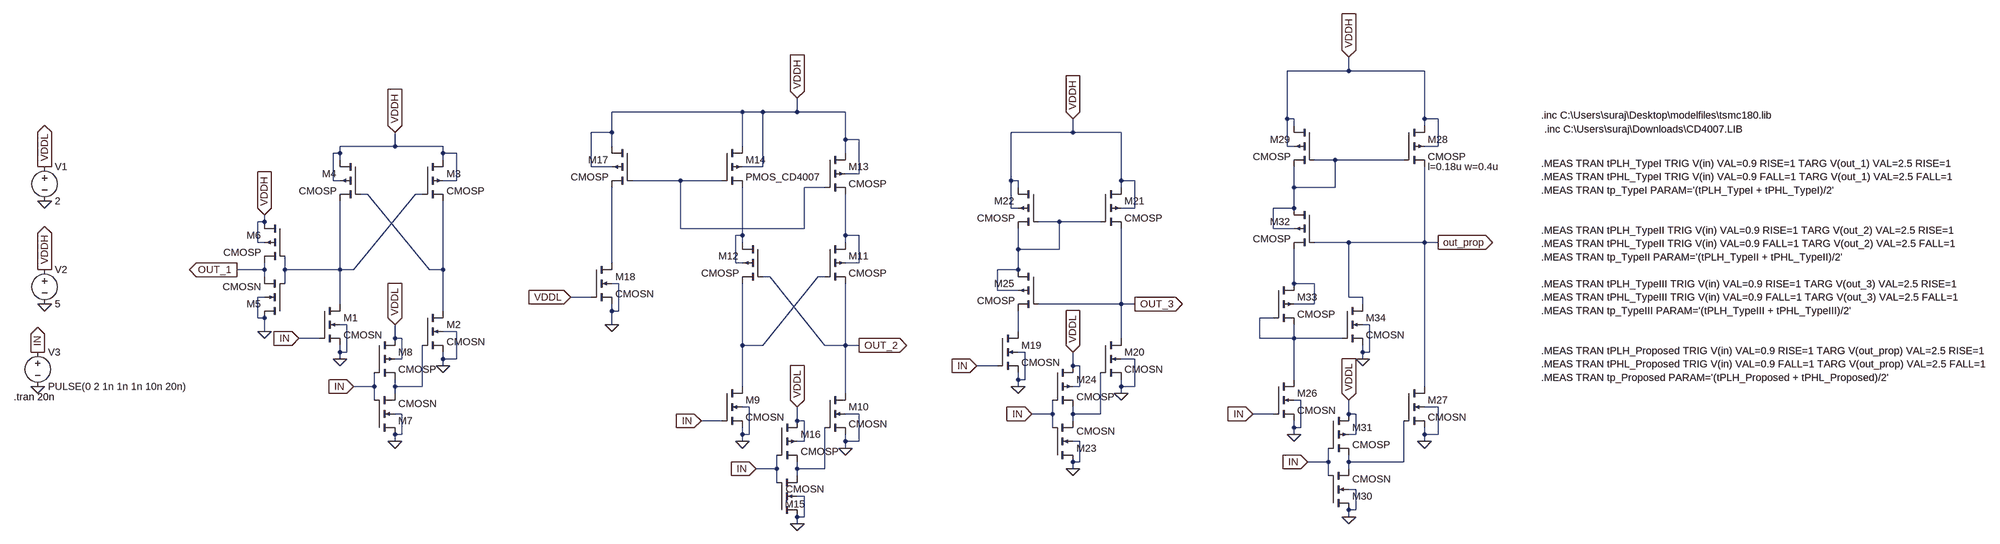
[diagram p0: schematic level_shifter_02.asc]
level_shifter_02.asc, the LTspice schematic file:
Version 4
SHEET 1 4096 1280
WIRE 2816 -160 2816 -192
WIRE 2816 -160 2672 -160
WIRE 2992 -160 2816 -160
WIRE 1168 -64 864 -64
WIRE 1216 -64 1168 -64
WIRE 1296 -64 1296 -96
WIRE 1296 -64 1216 -64
WIRE 1408 -64 1296 -64
WIRE 2672 -48 2672 -160
WIRE 2688 -48 2672 -48
WIRE 2992 -48 2992 -160
WIRE 3024 -48 2992 -48
WIRE 2688 -32 2688 -48
WIRE 2992 -32 2992 -48
WIRE 864 -16 864 -64
WIRE 864 -16 816 -16
WIRE 2080 -16 2080 -48
WIRE 2080 -16 1936 -16
WIRE 2192 -16 2080 -16
WIRE 1408 0 1408 -64
WIRE 1440 0 1408 0
WIRE 272 16 272 -16
WIRE 272 16 144 16
WIRE 384 16 272 16
WIRE 864 16 864 -16
WIRE 1168 16 1168 -64
WIRE 2672 16 2672 -48
WIRE 2688 16 2672 16
WIRE 3024 16 3024 -48
WIRE 3024 16 2992 16
WIRE 144 32 144 16
WIRE 144 32 128 32
WIRE 384 32 384 16
WIRE 416 32 384 32
WIRE 1408 32 1408 0
WIRE 144 48 144 32
WIRE 384 48 384 32
WIRE 2784 48 2736 48
WIRE 2944 48 2784 48
WIRE 816 64 816 -16
WIRE 864 64 816 64
WIRE 1216 64 1216 -64
WIRE 1216 64 1168 64
WIRE 1440 80 1440 0
WIRE 1440 80 1408 80
WIRE 128 96 128 32
WIRE 144 96 128 96
WIRE 416 96 416 32
WIRE 416 96 384 96
WIRE 1024 96 912 96
WIRE 1120 96 1024 96
WIRE 1936 96 1936 -16
WIRE 1952 96 1936 96
WIRE 2192 96 2192 -16
WIRE 2224 96 2192 96
WIRE 1360 112 1312 112
WIRE 1952 112 1952 96
WIRE 2192 112 2192 96
WIRE 2688 112 2688 64
WIRE 2784 112 2784 48
WIRE 2784 112 2688 112
WIRE 208 128 192 128
WIRE 336 128 320 128
WIRE 1936 160 1936 96
WIRE 1952 160 1936 160
WIRE 2224 160 2224 96
WIRE 2224 160 2192 160
WIRE 2688 160 2688 112
WIRE 2688 160 2640 160
WIRE -32 192 -32 176
WIRE -32 192 -48 192
WIRE 2048 192 2000 192
WIRE 2144 192 2048 192
WIRE 1024 208 1024 96
WIRE 1312 208 1312 112
WIRE 1312 208 1024 208
WIRE 2640 208 2640 160
WIRE 2688 208 2640 208
WIRE 1168 224 1168 112
WIRE 1168 224 1152 224
WIRE 1408 224 1408 128
WIRE 1440 224 1408 224
WIRE -48 240 -48 192
WIRE -32 240 -48 240
WIRE 1168 240 1168 224
WIRE 1408 240 1408 224
WIRE 2816 240 2736 240
WIRE 2992 240 2992 64
WIRE 2992 240 2816 240
WIRE 3024 240 2992 240
WIRE 1952 256 1952 208
WIRE 2048 256 2048 192
WIRE 2048 256 1952 256
WIRE 864 288 864 112
WIRE 1152 288 1152 224
WIRE 1168 288 1152 288
WIRE 1440 288 1440 224
WIRE 1440 288 1408 288
WIRE -32 304 -32 288
WIRE -32 304 -96 304
WIRE 16 304 16 272
WIRE 144 304 144 144
WIRE 144 304 16 304
WIRE 176 304 320 128
WIRE 176 304 144 304
WIRE 352 304 208 128
WIRE 384 304 384 144
WIRE 384 304 352 304
WIRE 1952 304 1952 256
WIRE 1952 304 1904 304
WIRE -32 320 -32 304
WIRE 1232 320 1216 320
WIRE 1360 320 1344 320
WIRE 16 336 16 304
WIRE 880 336 864 336
WIRE 2688 336 2688 256
WIRE 2736 336 2688 336
WIRE 1904 352 1904 304
WIRE 1952 352 1904 352
WIRE -32 368 -48 368
WIRE 816 368 768 368
WIRE 2816 368 2816 240
WIRE 2848 368 2816 368
WIRE 144 384 144 304
WIRE 2192 384 2192 208
WIRE 2192 384 2000 384
WIRE 2224 384 2192 384
WIRE 2736 384 2736 336
WIRE 2736 384 2688 384
WIRE 2848 384 2848 368
WIRE 384 400 384 304
WIRE 864 400 864 384
WIRE 880 400 880 336
WIRE 880 400 864 400
WIRE -48 416 -48 368
WIRE -32 416 -48 416
WIRE 2640 416 2608 416
WIRE 160 432 144 432
WIRE 864 432 864 400
WIRE 2864 432 2848 432
WIRE -32 448 -32 416
WIRE 416 448 384 448
WIRE 1952 448 1952 400
WIRE 96 464 48 464
WIRE 272 464 272 432
WIRE 288 464 272 464
WIRE 2192 464 2192 384
WIRE 2608 464 2608 416
WIRE 2688 464 2688 432
WIRE 2688 464 2608 464
WIRE 2800 464 2688 464
WIRE 1168 480 1168 336
WIRE 1216 480 1344 320
WIRE 1216 480 1168 480
WIRE 1360 480 1232 320
WIRE 1408 480 1408 336
WIRE 1408 480 1360 480
WIRE 1440 480 1408 480
WIRE 144 496 144 480
WIRE 160 496 160 432
WIRE 160 496 144 496
WIRE 1968 496 1952 496
WIRE 2848 496 2848 480
WIRE 2864 496 2864 432
WIRE 2864 496 2848 496
WIRE 144 512 144 496
WIRE 288 512 288 464
WIRE 288 512 272 512
WIRE 384 512 384 496
WIRE 416 512 416 448
WIRE 416 512 384 512
WIRE 2224 512 2192 512
WIRE 2848 512 2848 496
WIRE 384 528 384 512
WIRE 1904 528 1856 528
WIRE 2080 528 2080 496
WIRE 2096 528 2080 528
WIRE 1952 560 1952 544
WIRE 1968 560 1968 496
WIRE 1968 560 1952 560
WIRE 2688 560 2688 464
WIRE 224 576 224 544
WIRE 224 576 176 576
WIRE 272 576 272 560
WIRE 336 576 336 480
WIRE 336 576 272 576
WIRE 1168 576 1168 480
WIRE 1952 576 1952 560
WIRE 2096 576 2096 528
WIRE 2096 576 2080 576
WIRE 2192 576 2192 560
WIRE 2224 576 2224 512
WIRE 2224 576 2192 576
WIRE 2992 576 2992 240
WIRE 272 592 272 576
WIRE 1408 592 1408 480
WIRE 2192 592 2192 576
WIRE 224 608 224 576
WIRE 2704 608 2688 608
WIRE 1184 624 1168 624
WIRE 3024 624 2992 624
WIRE 288 640 272 640
WIRE 1440 640 1408 640
WIRE 2032 640 2032 608
WIRE 2032 640 1984 640
WIRE 2080 640 2080 624
WIRE 2144 640 2144 544
WIRE 2144 640 2080 640
WIRE 2640 640 2592 640
WIRE 2816 640 2816 608
WIRE 2832 640 2816 640
WIRE 1120 656 1072 656
WIRE 1296 656 1296 624
WIRE 1312 656 1296 656
WIRE 2080 656 2080 640
WIRE 2032 672 2032 640
WIRE 2688 672 2688 656
WIRE 2704 672 2704 608
WIRE 2704 672 2688 672
WIRE 288 688 288 640
WIRE 288 688 272 688
WIRE 1168 688 1168 672
WIRE 1184 688 1184 624
WIRE 1184 688 1168 688
WIRE 2688 688 2688 672
WIRE 2832 688 2832 640
WIRE 2832 688 2816 688
WIRE 2992 688 2992 672
WIRE 3024 688 3024 624
WIRE 3024 688 2992 688
WIRE 272 704 272 688
WIRE 1168 704 1168 688
WIRE 1312 704 1312 656
WIRE 1312 704 1296 704
WIRE 1408 704 1408 688
WIRE 1440 704 1440 640
WIRE 1440 704 1408 704
WIRE 2096 704 2080 704
WIRE 2992 704 2992 688
WIRE 1408 720 1408 704
WIRE 2096 752 2096 704
WIRE 2096 752 2080 752
WIRE 2768 752 2768 720
WIRE 2768 752 2720 752
WIRE 2816 752 2816 736
WIRE 2944 752 2944 656
WIRE 2944 752 2816 752
WIRE 1248 768 1248 736
WIRE 1248 768 1200 768
WIRE 1296 768 1296 752
WIRE 1360 768 1360 672
WIRE 1360 768 1296 768
WIRE 2080 768 2080 752
WIRE 2816 768 2816 752
WIRE 1296 784 1296 768
WIRE 2768 784 2768 752
WIRE 1248 800 1248 768
WIRE 2832 816 2816 816
WIRE 1312 832 1296 832
WIRE 2832 864 2832 816
WIRE 2832 864 2816 864
WIRE 1312 880 1312 832
WIRE 1312 880 1296 880
WIRE 2816 880 2816 864
WIRE 1296 896 1296 880
FLAG 144 512 0
FLAG 272 704 0
FLAG 272 -16 VDDH
IOPIN 272 -16 In
FLAG -32 176 VDDH
IOPIN -32 176 In
FLAG 272 432 VDDL
IOPIN 272 432 In
FLAG 48 464 IN
IOPIN 48 464 In
FLAG 176 576 IN
IOPIN 176 576 In
FLAG -32 448 0
FLAG 384 528 0
FLAG -96 304 OUT_1
IOPIN -96 304 Out
FLAG -560 576 0
FLAG -544 384 0
FLAG -544 144 0
FLAG -544 64 VDDL
IOPIN -544 64 Out
FLAG -544 304 VDDH
IOPIN -544 304 Out
FLAG -560 496 IN
IOPIN -560 496 Out
FLAG 1168 704 0
FLAG 1296 896 0
FLAG 1296 -96 VDDH
IOPIN 1296 -96 In
FLAG 1296 624 VDDL
IOPIN 1296 624 In
FLAG 1072 656 IN
IOPIN 1072 656 In
FLAG 1200 768 IN
IOPIN 1200 768 In
FLAG 1408 720 0
FLAG 864 432 0
FLAG 768 368 VDDL
IOPIN 768 368 In
FLAG 1952 576 0
FLAG 2080 768 0
FLAG 2080 -48 VDDH
IOPIN 2080 -48 In
FLAG 2080 496 VDDL
IOPIN 2080 496 In
FLAG 1856 528 IN
IOPIN 1856 528 In
FLAG 1984 640 IN
IOPIN 1984 640 In
FLAG 2192 592 0
FLAG 2224 384 OUT_3
IOPIN 2224 384 Out
FLAG 2688 688 0
FLAG 2816 880 0
FLAG 2816 -192 VDDH
IOPIN 2816 -192 In
FLAG 2816 608 VDDL
IOPIN 2816 608 In
FLAG 2592 640 IN
IOPIN 2592 640 In
FLAG 2720 752 IN
IOPIN 2720 752 In
FLAG 2992 704 0
FLAG 3024 240 out_prop
IOPIN 3024 240 Out
FLAG 2848 512 0
FLAG 1440 480 OUT_2
IOPIN 1440 480 Out
SYMBOL nmos4 96 384 R0
SYMATTR InstName M1
SYMATTR Value CMOSN
SYMATTR Value2 l=0.18u w=2u
SYMBOL nmos4 336 400 R0
SYMATTR InstName M2
SYMATTR Value CMOSN
SYMATTR Value2 l=0.18u w=3u
SYMBOL pmos4 336 48 R0
SYMATTR InstName M3
SYMATTR Value CMOSP
SYMATTR Value2 l=0.18u w=0.4u
SYMBOL pmos4 192 48 M0
SYMATTR InstName M4
SYMATTR Value CMOSP
SYMATTR Value2 l=5u w=0.4u
SYMBOL nmos4 16 416 R180
SYMATTR InstName M5
SYMATTR Value CMOSN
SYMATTR Value2 l=0.18u w=5u
SYMBOL pmos4 16 192 M0
SYMATTR InstName M6
SYMATTR Value CMOSP
SYMATTR Value2 l=0.18u w=10u
SYMBOL nmos4 224 688 M180
SYMATTR InstName M7
SYMATTR Value CMOSN
SYMATTR Value2 l=0.18u w=5u
SYMBOL pmos4 224 464 R0
SYMATTR InstName M8
SYMATTR Value CMOSP
SYMATTR Value2 l=0.18u w=10u
SYMBOL voltage -544 48 R0
WINDOW 123 0 0 Left 0
WINDOW 39 0 0 Left 0
SYMATTR InstName V1
SYMATTR Value 2
SYMBOL voltage -544 288 R0
WINDOW 123 0 0 Left 0
WINDOW 39 0 0 Left 0
SYMATTR InstName V2
SYMATTR Value 5
SYMBOL voltage -560 480 R0
WINDOW 123 0 0 Left 0
WINDOW 39 0 0 Left 0
SYMATTR InstName V3
SYMATTR Value PULSE(0 2 1n 1n 1n 10n 20n)
SYMBOL nmos4 1120 576 R0
SYMATTR InstName M9
SYMATTR Value CMOSN
SYMATTR Value2 l=0.18u w=3u
SYMBOL nmos4 1360 592 R0
SYMATTR InstName M10
SYMATTR Value CMOSN
SYMATTR Value2 l=0.18u w=4u
SYMBOL pmos4 1360 240 R0
SYMATTR InstName M11
SYMATTR Value CMOSP
SYMATTR Value2 l=0.18u w=0.4u
SYMBOL pmos4 1216 240 M0
SYMATTR InstName M12
SYMATTR Value CMOSP
SYMATTR Value2 l=0.18u w=0.4u
SYMBOL nmos4 1248 880 M180
WINDOW 0 19 30 Left 2
WINDOW 3 21 65 Left 2
SYMATTR InstName M15
SYMATTR Value CMOSN
SYMATTR Value2 l=0.18u w=1u
SYMBOL pmos4 1248 656 R0
SYMATTR InstName M16
SYMATTR Value CMOSP
SYMATTR Value2 l=0.18u w=2u
SYMBOL pmos4 1360 32 R0
SYMATTR InstName M13
SYMATTR Value CMOSP
SYMATTR Value2 l=0.18u w=0.40u
SYMBOL pmos4 1120 16 R0
SYMATTR InstName M14
SYMATTR Value2 l=5u w=10u
SYMATTR Value PMOS_CD4007
SYMBOL pmos4 912 16 M0
SYMATTR InstName M17
SYMATTR Value CMOSP
SYMATTR Value2 l=5u w=0.4u
SYMBOL nmos4 816 288 R0
SYMATTR InstName M18
SYMATTR Value CMOSN
SYMATTR Value2 l=0.18u w=3u
SYMBOL nmos4 1904 448 R0
SYMATTR InstName M19
SYMATTR Value CMOSN
SYMATTR Value2 l=0.18u w=3u
SYMBOL nmos4 2144 464 R0
SYMATTR InstName M20
SYMATTR Value CMOSN
SYMATTR Value2 l=0.18u w=2u
SYMBOL pmos4 2144 112 R0
SYMATTR InstName M21
SYMATTR Value CMOSP
SYMATTR Value2 l=0.18u w=0.2u
SYMBOL pmos4 2000 112 M0
SYMATTR InstName M22
SYMATTR Value CMOSP
SYMATTR Value2 l=5u w=0.4u
SYMBOL nmos4 2032 752 M180
SYMATTR InstName M23
SYMATTR Value CMOSN
SYMATTR Value2 l=0.18u w=2u
SYMBOL pmos4 2032 528 R0
SYMATTR InstName M24
SYMATTR Value CMOSP
SYMATTR Value2 l=0.18u w=4u
SYMBOL pmos4 2000 304 M0
SYMATTR InstName M25
SYMATTR Value CMOSP
SYMATTR Value2 l=0.18u w=0.2u
SYMBOL nmos4 2640 560 R0
SYMATTR InstName M26
SYMATTR Value CMOSN
SYMATTR Value2 l=0.18u w=5u
SYMBOL nmos4 2944 576 R0
SYMATTR InstName M27
SYMATTR Value CMOSN
SYMATTR Value2 l=0.18u w=2u
SYMBOL pmos4 2944 -32 R0
WINDOW 123 56 96 Left 2
SYMATTR Value2 l=0.18u w=0.4u
SYMATTR InstName M28
SYMATTR Value CMOSP
SYMBOL pmos4 2736 -32 M0
SYMATTR InstName M29
SYMATTR Value CMOSP
SYMATTR Value2 l=5u w=0.2u
SYMBOL nmos4 2768 864 M180
SYMATTR InstName M30
SYMATTR Value CMOSN
SYMATTR Value2 l=0.18u w=1u
SYMBOL pmos4 2768 640 R0
SYMATTR InstName M31
SYMATTR Value CMOSP
SYMATTR Value2 l=0.18u w=2u
SYMBOL pmos4 2736 160 M0
SYMATTR InstName M32
SYMATTR Value CMOSP
SYMATTR Value2 l=0.18u w=0.4u
SYMBOL pmos4 2640 336 R0
SYMATTR InstName M33
SYMATTR Value CMOSP
SYMATTR Value2 l=0.18u w=0.4u
SYMBOL nmos4 2800 384 R0
SYMATTR InstName M34
SYMATTR Value CMOSN
SYMATTR Value2 l=0.18u w=0.4u
TEXT -616 600 Left 2 !.tran 20n
TEXT 3272 -56 Left 2 !.inc C:\\Users\\suraj\\Desktop\\modelfiles\\tsmc180.lib
TEXT 3280 -24 Left 2 !.inc C:\\Users\\suraj\\Downloads\\CD4007.LIB
TEXT 3272 56 Left 2 !.MEAS TRAN tPLH_TypeI TRIG V(in) VAL=0.9 RISE=1 TARG V(out_1) VAL=2.5 RISE=1\n.MEAS TRAN tPHL_TypeI TRIG V(in) VAL=0.9 FALL=1 TARG V(out_1) VAL=2.5 FALL=1\n.MEAS TRAN tp_TypeI PARAM='(tPLH_TypeI + tPHL_TypeI)/2'\n \n \n.MEAS TRAN tPLH_TypeII TRIG V(in) VAL=0.9 RISE=1 TARG V(out_2) VAL=2.5 RISE=1\n.MEAS TRAN tPHL_TypeII TRIG V(in) VAL=0.9 FALL=1 TARG V(out_2) VAL=2.5 FALL=1\n.MEAS TRAN tp_TypeII PARAM='(tPLH_TypeII + tPHL_TypeII)/2'\n \n.MEAS TRAN tPLH_TypeIII TRIG V(in) VAL=0.9 RISE=1 TARG V(out_3) VAL=2.5 RISE=1\n.MEAS TRAN tPHL_TypeIII TRIG V(in) VAL=0.9 FALL=1 TARG V(out_3) VAL=2.5 FALL=1\n.MEAS TRAN tp_TypeIII PARAM='(tPLH_TypeIII + tPHL_TypeIII)/2'\n \n \n.MEAS TRAN tPLH_Proposed TRIG V(in) VAL=0.9 RISE=1 TARG V(out_prop) VAL=2.5 RISE=1\n.MEAS TRAN tPHL_Proposed TRIG V(in) VAL=0.9 FALL=1 TARG V(out_prop) VAL=2.5 FALL=1\n.MEAS TRAN tp_Proposed PARAM='(tPLH_Proposed + tPHL_Proposed)/2'

The netlist it stands for:
* level_shifter_02.asc
M1 N004 IN 0 0 CMOSN l=0.18u w=2u
M2 N003 N013 0 0 CMOSN l=0.18u w=3u
M3 VDDH N004 N003 VDDH CMOSP l=0.18u w=0.4u
M4 VDDH N003 N004 VDDH CMOSP l=5u w=0.4u
M5 0 N004 OUT_1 0 CMOSN l=0.18u w=5u
M6 VDDH N004 OUT_1 VDDH CMOSP l=0.18u w=10u
M7 0 IN N013 0 CMOSN l=0.18u w=5u
M8 VDDL IN N013 VDDL CMOSP l=0.18u w=10u
V1 VDDL 0 2
V2 VDDH 0 5
V3 IN 0 PULSE(0 2 1n 1n 1n 10n 20n)
M9 N009 IN 0 0 CMOSN l=0.18u w=3u
M10 OUT_2 N016 0 0 CMOSN l=0.18u w=4u
M11 N007 N009 OUT_2 N007 CMOSP l=0.18u w=0.4u
M12 N006 OUT_2 N009 N006 CMOSP l=0.18u w=0.4u
M15 0 IN N016 0 CMOSN l=0.18u w=1u
M16 VDDL IN N016 VDDL CMOSP l=0.18u w=2u
M13 VDDH N002 N007 VDDH CMOSP l=0.18u w=0.40u
M14 VDDH N002 N006 VDDH PMOS_CD4007 l=5u w=10u
M17 VDDH N002 N008 VDDH CMOSP l=5u w=0.4u
M18 N008 VDDL 0 0 CMOSN l=0.18u w=3u
M19 N012 IN 0 0 CMOSN l=0.18u w=3u
M20 OUT_3 N014 0 0 CMOSN l=0.18u w=2u
M21 VDDH N005 OUT_3 VDDH CMOSP l=0.18u w=0.2u
M22 VDDH N005 N005 VDDH CMOSP l=5u w=0.4u
M23 0 IN N014 0 CMOSN l=0.18u w=2u
M24 VDDL IN N014 VDDL CMOSP l=0.18u w=4u
M25 N005 OUT_3 N012 N005 CMOSP l=0.18u w=0.2u
M26 N011 IN 0 0 CMOSN l=0.18u w=5u
M27 out_prop N015 0 0 CMOSN l=0.18u w=2u
M28 VDDH N001 out_prop VDDH CMOSP l=0.18u w=0.4u
M29 VDDH N001 N001 VDDH CMOSP l=5u w=0.2u
M30 0 IN N015 0 CMOSN l=0.18u w=1u
M31 VDDL IN N015 VDDL CMOSP l=0.18u w=2u
M32 N001 out_prop N010 N001 CMOSP l=0.18u w=0.4u
M33 N010 N011 N011 N010 CMOSP l=0.18u w=0.4u
M34 out_prop N011 0 0 CMOSN l=0.18u w=0.4u
.model NMOS NMOS
.model PMOS PMOS
.lib standard.mos
.tran 20n
.inc C:\Users\suraj\Desktop\modelfiles\tsmc180.lib
.inc C:\Users\suraj\Downloads\CD4007.LIB
.MEAS TRAN tPLH_TypeI TRIG V(in) VAL=0.9 RISE=1 TARG V(out_1) VAL=2.5 RISE=1
.MEAS TRAN tPHL_TypeI TRIG V(in) VAL=0.9 FALL=1 TARG V(out_1) VAL=2.5 FALL=1
.MEAS TRAN tp_TypeI PARAM='(tPLH_TypeI + tPHL_TypeI)/2'
.MEAS TRAN tPLH_TypeII TRIG V(in) VAL=0.9 RISE=1 TARG V(out_2) VAL=2.5 RISE=1
.MEAS TRAN tPHL_TypeII TRIG V(in) VAL=0.9 FALL=1 TARG V(out_2) VAL=2.5 FALL=1
.MEAS TRAN tp_TypeII PARAM='(tPLH_TypeII + tPHL_TypeII)/2'
.MEAS TRAN tPLH_TypeIII TRIG V(in) VAL=0.9 RISE=1 TARG V(out_3) VAL=2.5 RISE=1
.MEAS TRAN tPHL_TypeIII TRIG V(in) VAL=0.9 FALL=1 TARG V(out_3) VAL=2.5 FALL=1
.MEAS TRAN tp_TypeIII PARAM='(tPLH_TypeIII + tPHL_TypeIII)/2'
.MEAS TRAN tPLH_Proposed TRIG V(in) VAL=0.9 RISE=1 TARG V(out_prop) VAL=2.5 RISE=1
.MEAS TRAN tPHL_Proposed TRIG V(in) VAL=0.9 FALL=1 TARG V(out_prop) VAL=2.5 FALL=1
.MEAS TRAN tp_Proposed PARAM='(tPLH_Proposed + tPHL_Proposed)/2'
.backanno
.end